# Altium project FireBeetle ESP32 IoT & Sensors.PrjPcb
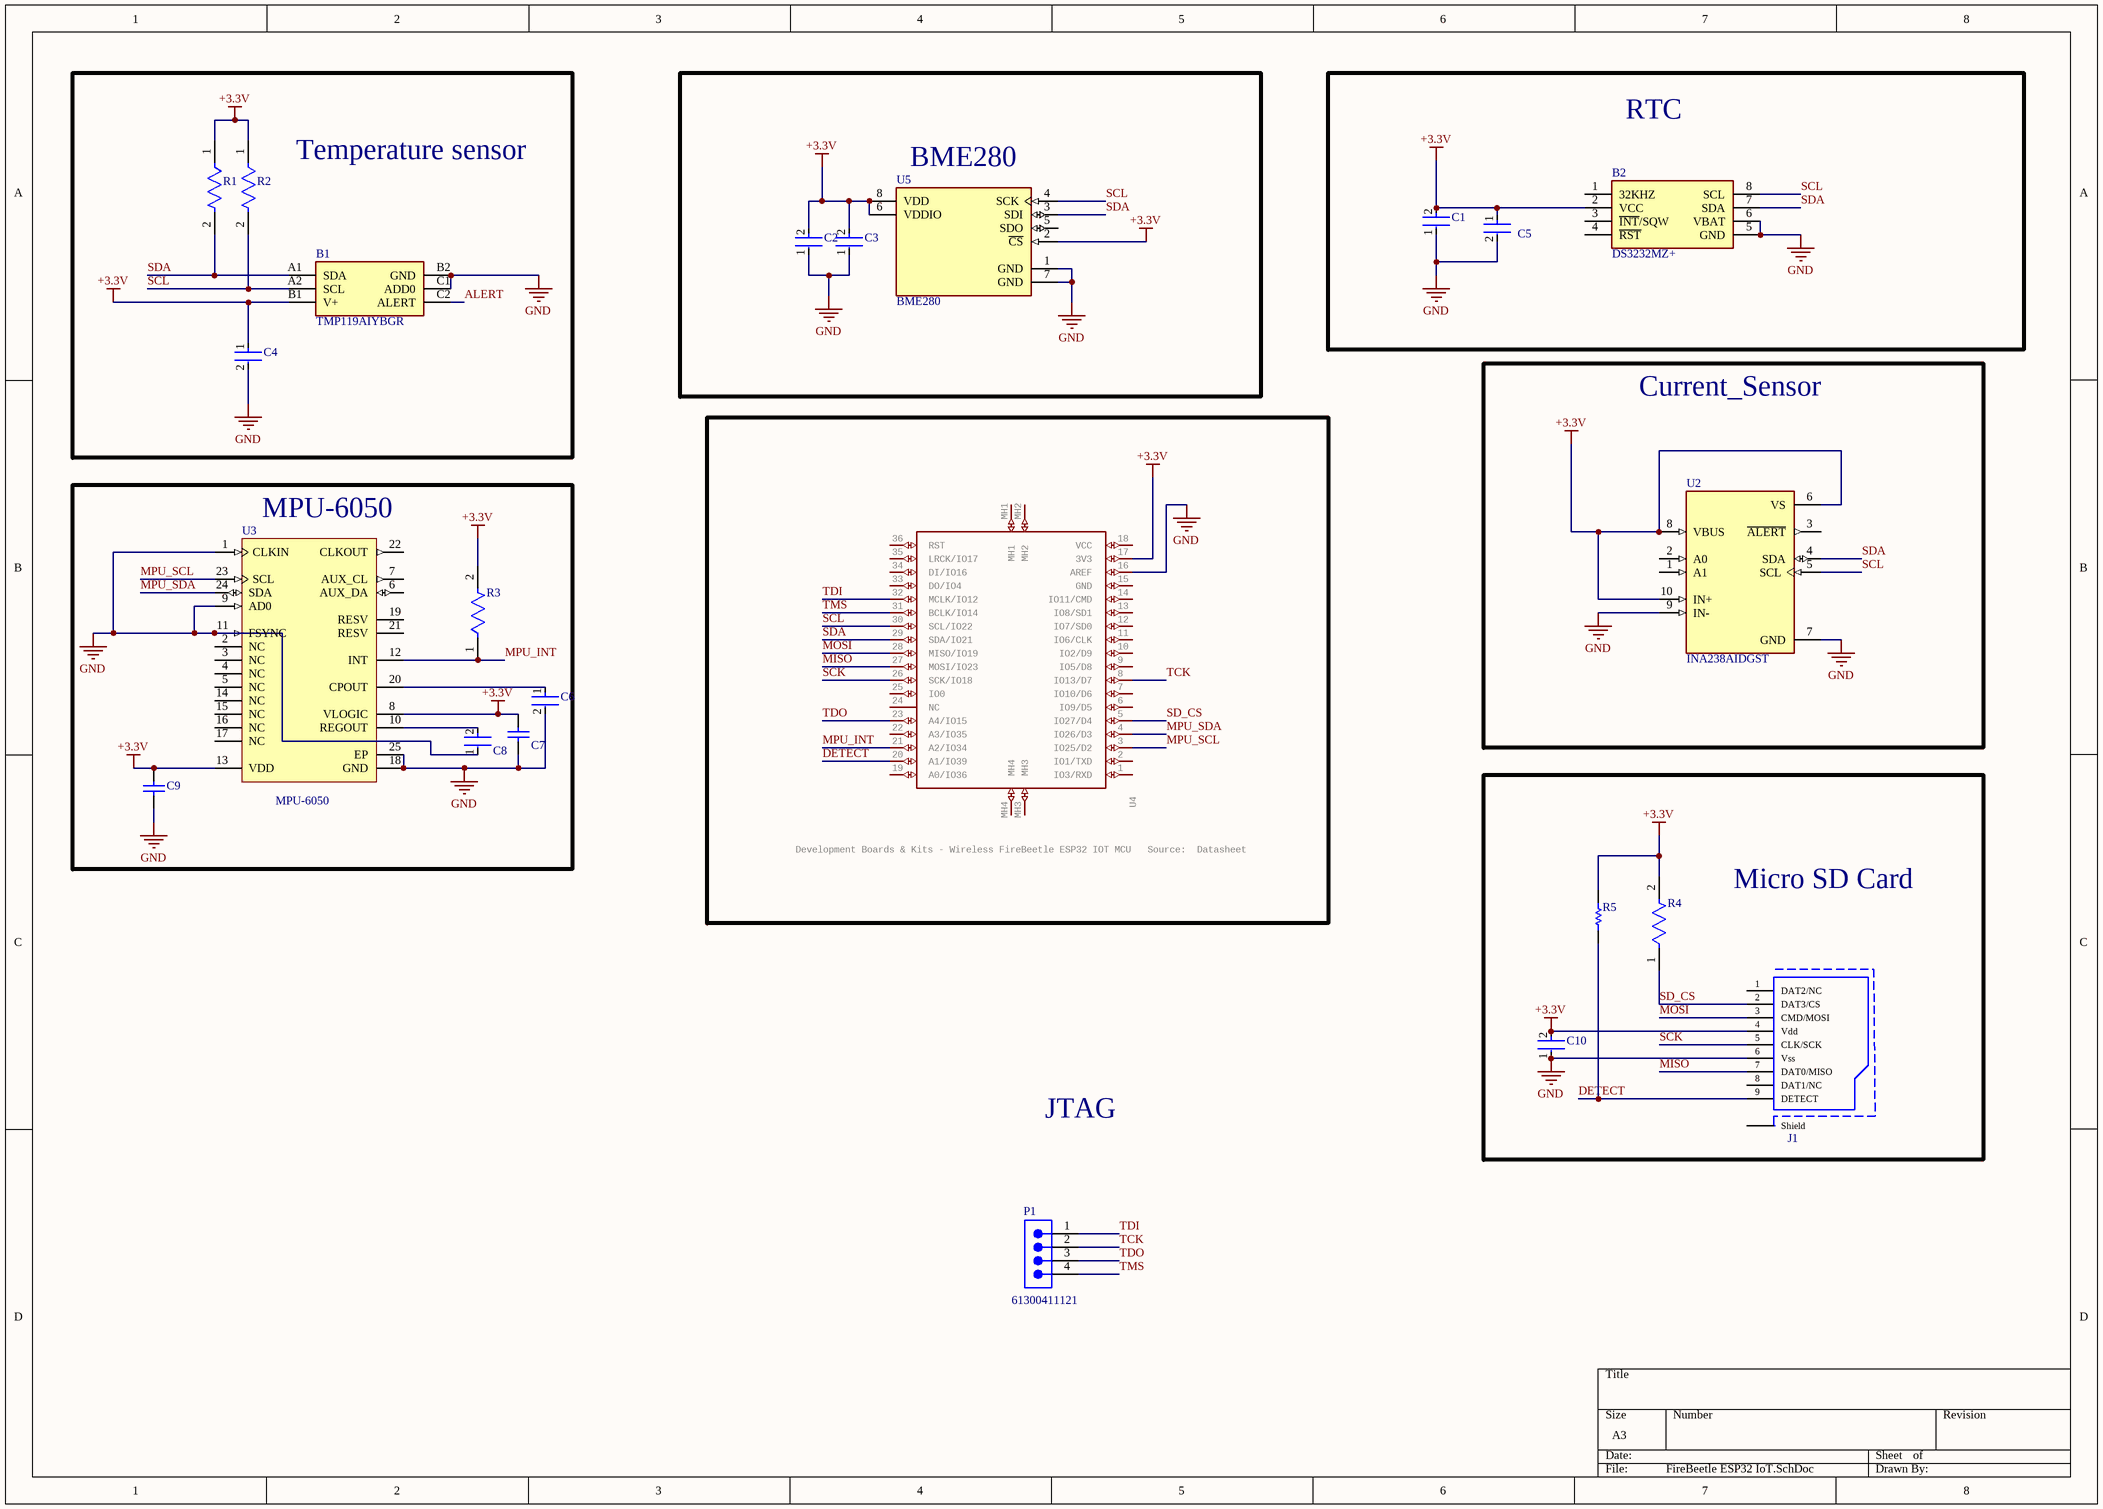
[diagram p0: FireBeetle ESP32 IoT.SchDoc]
1 sheet, 23 parts. Net scope: global (net labels, ports and power ports of the same name join across sheets).
Board file: FireBeetle ESP32 IoT & Sensors.PcbDoc

## Sheet FireBeetle ESP32 IoT.SchDoc
size A3; SheetNumber: 1; SheetTotal: 1

### Parts
B1  TMP119AIYBGR  [BGA6C40P2X3_95X149X52]
B2  DS3232MZ+  [SOIC127P600X175-8N]
C1  GRM155R71C104KA88D  [FP-GRM15-MFG]  (value not drawn)
C2  GRM155R71C104KA88D  [FP-GRM15-MFG]  (value not drawn)
C3  GRM155R71C104KA88D  [FP-GRM15-MFG]  (value not drawn)
C4  CC0201KRX5R5BB104  [FP-CC0201-BA-MFG]  (value not drawn)
C5  GRM155R61A105KE15D  [FP-GRM15-0_1-MFG]  (value not drawn)
C6  GRM155R71H222KA01D  [FP-GRM155-0_05-IPC_B]  (value not drawn)
C7  GRM155R71E103KA01D  [CAPC1005X55X25ML05T10]  (value not drawn)
C8  GRM155R71C104KA88D  [FP-GRM15-MFG]  (value not drawn)
C9  GRM155R61A104KA01D  [CAPC1005X55X25ML5T10]  (value not drawn)
C10  GRM155R71C104KA88D  [FP-GRM15-MFG]  (value not drawn)
J1  Micro SD  [TFP-09-2-12B]  (value not drawn)
P1  61300411121  [61300411121]
R1  ERJ-1GNF4701C  [FP-ERJ0201-MFG]  (value not drawn)
R2  ERJ-1GNF4701C  [FP-ERJ0201-MFG]  (value not drawn)
R3  ERJ-2RKF1003X  [FP-ERJ2RK-IPC_C]  (value not drawn)
R4  ERJ-2RKF1003X  [FP-ERJ2RK-IPC_C]  (value not drawn)
R5  ERJ-2RKF1004X  [RESC1005X40X25LL05T05]  (value not drawn)
U2  INA238AIDGST  [SOP50P490X110-10N]
U3  MPU-6050  [IS-QFN-24_V]
U4  Development Boards & Kits - Wireless FireBeetle ESP32 IOT MCU   Source:  Datasheet  [FIREBEETLE_ESP32]
U5  BME280  [FP-BME280-MFG]

### Blocks framed on the sheet
Temperature sensor: B1 C4 R1 R2
BME280: C2 C3 U5
RTC: B2 C1 C5
Current_Sensor: U2
MPU-6050: C6-C9 R3 U3
Micro SD Card: C10 J1 R4 R5

### Nets
+3.3V: B1.B1(V+) B2.2(VCC) C1.2 C2.2 C3.2 C4.1 C5.1 C7.2 C9.2 C10.2 J1.4(Vdd) R1.1 R2.1 R3.2 R4.2 R5.2 U2.6(VS) U2.8(VBUS) U2.10(IN+) U3.8(VLOGIC) U3.13(VDD) U4.17(3V3) U5.2(~{CS}) U5.6(VDDIO) U5.8(VDD)
GND: B1.B2(GND) B1.C1(ADD0) B2.5(GND) B2.6(VBAT) C1.1 C2.1 C3.1 C4.2 C5.2 C6.2 C7.1 C8.1 C9.1 C10.1 J1.6(Vss) U2.7(GND) U2.9(IN-) U3.1(CLKIN) U3.9(AD0) U3.11(FSYNC) U3.18(GND) U3.25(EP) U4.16(AREF) U5.1(GND) U5.7(GND)
ALERT: B1.C2(ALERT)
DETECT: J1.9(DETECT) R5.1 U4.20(A1/IO39)
MISO: J1.7(DAT0/MISO) U4.27(MOSI/IO23)
MOSI: J1.3(CMD/MOSI) U4.28(MISO/IO19)
MPU_INT: R3.1 U3.12(INT) U4.21(A2/IO34)
MPU_SCL: U3.23(SCL) U4.3(IO25/D2)
MPU_SDA: U3.24(SDA) U4.4(IO26/D3)
SCK: J1.5(CLK/SCK) U4.26(SCK/IO18)
SCL: B1.A2(SCL) B2.8(SCL) R2.2 U2.5(SCL) U4.30(SCL/IO22) U5.4(SCK)
SD_CS: J1.2(DAT3/CS) R4.1 U4.5(IO27/D4)
SDA: B1.A1(SDA) B2.7(SDA) R1.2 U2.4(SDA) U4.29(SDA/IO21) U5.3(SDI)
TCK: P1.2 U4.8(IO13/D7)
TDI: P1.1 U4.32(MCLK/IO12)
TDO: P1.3 U4.23(A4/IO15)
TMS: P1.4 U4.31(BCLK/IO14)
NetC6_1: C6.1 U3.20(CPOUT)
NetC8_2: C8.2 U3.10(REGOUT)

Not connected (* = marked no-connect by the designer): B2 1(32KHZ) 3(~{INT}/SQW) 4(~{RST}); J1 1(DAT2/NC) 8(DAT1/NC) 10(Shield); U2 1(A1) 2(A0) 3(~{ALERT}); U3 2(NC) 3(NC) 4(NC) 5(NC) 6(AUX_DA) 7(AUX_CL) 14(NC) 15(NC) 16(NC) 17(NC) 19(RESV) 21(RESV) 22(CLKOUT); U4 1(IO3/RXD) 2(IO1/TXD) 6(IO9/D5) 7(IO10/D6) 9(IO5/D8) 10(IO2/D9) 11(IO6/CLK) 12(IO7/SD0) 13(IO8/SD1) 14(IO11/CMD) 15(GND) 18(VCC) 19(A0/IO36) 22(A3/IO35) 24(NC) 25(IO0) 33(DO/IO4) 34(DI/IO16) 35(LRCK/IO17) 36(RST) MH1 MH2 MH3 MH4; U5 5(SDO)

### Notes on the sheet
- JTAG

### Library data of the parts
B1 = TMP119AIYBGR: Board Mount Temperature Sensors TEMPERATURE SENSOR; Manufacturer_Name: Texas Instruments; Geometry.Height: 0.525mm; Manufacturer_Part_Number: TMP119AIYBGR; Mouser Part Number: *; Mouser Price/Stock: *; Arrow Part Number: *; Arrow Price/Stock: *; Datasheet Link: https://www.ti.com/lit/ds/symlink/tmp119.pdf?ts=1711471230059&ref_url=https%253A%252F%252Fwww.ti.com%252Fsitesearch%252Fen-us%252Fdocs%252Funiversalsearch.tsp%253FlangPref%253Den-US%2526searchTerm%253Dtmp119%2526nr%253D70
B2 = DS3232MZ+: Real Time Clock with SRAM I2C SOIC8 Maxim DS3232MZ+ Real Time Clock  Calendar, 236B RAM 8-Pin SOIC; Manufacturer_Name: Analog Devices; Geometry.Height: 1.75mm; Manufacturer_Part_Number: DS3232MZ+; Mouser Part Number: 700-DS3232MZ+; Mouser Price/Stock: https://www.mouser.co.uk/ProductDetail/Analog-Devices-Maxim-Integrated/DS3232MZ%2b?qs=jx0ze0HFsp7XmMGNDj6kPg%3D%3D; Arrow Part Number: DS3232MZ+; Arrow Price/Stock: https://www.arrow.com/en/products/ds3232mz/analog-devices?region=nac; Datasheet Link: https://datasheets.maximintegrated.com/en/ds/DS3232M.pdf
C1-C3 C8 C10 = CMP-2100-03641-2: CAP CER 0.1UF 16V X7R 0402; Manufacturer: Murata; Standoff Height: 0mm; Tolerance: 10%; Voltage Rating: 16Vdc; Material: Ceramic; Capacitance: 0.10μF; Value: 0.10μF; RoHS: TRUE; Manufacturer Part Number: GRM155R71C104KA88D; Temperature Characteristic: X7R; Octopart: https://octopart.com/grm155r71c104ka88d-murata-196880; Digikey Description: CAP CER 0.1UF 16V X7R 0402; Device Class L3: Ceramic Capacitors; Height: 0.55mm; ComponentLink2Description: Datasheet; Temperature Range Low: -55°C; Ipc Land Pattern Name: CAPC10050X219; ComponentLink2URL: https://search.murata.co.jp/Ceramy/image/img/A01X/G101/ENG/GRM155R71H471KA01-01A.pdf; Device Class L1: Passive Components; Lead Free: yes; Category: Cap; Package: GRM15; Temperature: -55°C to +125°C; Device Class L2: Capacitors; Temperature Range High: +125°C; Mouser Description: 0402 0.1 uF 16V ±10 % Tolerance X7R SMT Multilayer Ceramic Capacitor
C4 = CMP-03422-000376-1: CAP CER 0.1UF 6.3V X5R 0201; Manufacturer: Yageo; Tolerance: 0.1; Temperature Coefficient: 15%; Value: 100 nF; Material: Ceramic; Automotive: No; Device Class L2: Capacitors; Temperature Range High: +85°C; Capacitance: 100 nF; Temperature: -55°C to +85°C; ComponentLink2URL: http://www.yageo.com/documents/recent/UPY-GPHC_X5R_4V-to-50V_25.pdf; Category: Cap; Mouser Description: Multilayer Ceramic Capacitors MLCC - SMD/SMT 100nF 6.3V X5R 10%; Ipc Land Pattern Name: CAPC6030X30; Temperature Characteristic: X5R; Voltage Rating: 6.3 V; Lead Free: Yes; Digikey Description: CAP CER 0.1UF 6.3V X5R 0201; Device Class L1: Passive Components; Octopart: https://octopart.com/cc0201krx5r5bb104-yageo-9292636; Height: 0.33mm; Package: CC0201-BA; Footprint Url: http://www.yageo.com/exep/pages/download/literatures/UPY-C_GEN_24.pdf; ComponentLink2Description: Datasheet; Device Class L3: Ceramic Capacitors; Temperature Range Low: -55°C; RoHS: TRUE; Manufacturer Part Number: CC0201KRX5R5BB104
C5 = CMP-2008-04556-2: CAP CER 1UF 10V X5R 0402; Manufacturer: Murata; Material: Ceramic; Tolerance: 10%; Temperature Coefficient: 15%; Octopart: https://octopart.com/grm155r61a105ke15d-murata-197442; Manufacturer Part Number: GRM155R61A105KE15D; Lead Free: Yes; ComponentLink2Description: Datasheet; Temperature: -55°C to +85°C; Temperature Range High: +85°C; Height: 0.55mm; Capacitance: 1uF; Ipc Land Pattern Name: CAPC10050X50; ComponentLink2URL: https://search.murata.co.jp/Ceramy/image/img/A01X/G101/ENG/GRM155R61A105KE15-01A.pdf; Temperature Range Low: -55°C; Device Class L2: Capacitors; Voltage Rating: 10V; RoHS: TRUE; Device Class L1: Passive Components; Device Class L3: Ceramic Capacitors; Temperature Characteristic: X5R; Mouser Description: 0402 1 uF 10 V ±10% Tolerance X5R Surface Mount Multilayer Ceramic Capacitor; Automotive: No; Package: GRM15-0.1; Digikey Description: CAP CER 1UF 10V X5R 0402; Value: 1uF; Category: Cap
C6 = CMP-2008-04653-5: Chip Multilayer Ceramic Capacitors for General Purpose, 0402, 2200pF, X7R, 15%, 10%, 50V; Capacitance: 2.2nF; Voltage: 50V; Case/Package: 0402; Case Code (Imperial): 0402; Dielectric: X7R; Thickness: 0.022inch; Number of Pins: 2; Voltage Rating (DC): 50V; Weight: 2.3E-05oz; Min Operating Temperature: -55°C; REACH SVHC: No SVHC; Length: 1mm; Case Code (Metric): 1005; Lead Free: Lead Free; Tolerance: 10%; Max Operating Temperature: 125°C; Package Quantity: 1; Packaging: Tape and Reel; Termination: SMD/SMT; Radiation Hardening: No; Depth: 0.5mm; Material: Ceramic; Width: 0.5mm; Mount: Surface Mount; Voltage Rating: 50V; Height: 0.5mm
C7 = CMP-1034-01880-2: Manufacturer: Murata; Part Number: GRM155R71E103KA01D
C9 = CMP-1662-00019-1: Chip Capacitor, 100 nF, +/- 10%, 10 V, -55 to 85 degC, 0402 (1005 Metric), RoHS, Tape and Reel; Capacitance: 100 nF; Type (Capacitors): X5R; Voltage Rating: 10 V; ComponentLink2Description: Datasheet; Package Quantity: 1; PackageDescription: 2-Pin Surface Mount Device, Body 1 x 0.5 mm; DatasheetVersion: 05/2014; ComponentLink2URL: https://datasheet.ciiva.com/18102/getdatasheetpartid-74533-18102605.pdf; Case/Package: 0402; Case Code (Metric): 1005; Mounting Technology: Surface Mount; Max Operating Temperature: 85 degC; RoHSCompliant: true; Case Code (Imperial): 0402; ComponentLink1URL: http://www.murata.com/; ComponentLink1Description: Manufacturer URL; Pins: 2; Length: 1 mm; Width: 0.5 mm; Radiation Hardening: No; Voltage Rating (DC): 10 V; Tolerance: 10%; Packaging: Cut Tape; PartNumber: GRM155R61A104KA01D; Height: 0.5 mm; REACH SVHC: Unknown; Mount: Surface Mount; Min Operating Temperature: -55 degC
J1 = Micro SD TFP-09-2-12B: PartNumber: TFP-09-2-12B
P1 = CMP-1502-01064-2: NexarPartId: 32855522; Pitch: 2.54mm; Number of Contacts: 4; Contact Resistance: 20mΩ; Gender: Male; Current Rating: 3A; Connector Type: Male Pin; Voltage Rating: 250V; Lead Free: Lead Free; Contact Plating: Gold; Max Operating Temperature: 105°C; Packaging: Bulk; Height: 8.89mm; Orientation: Vertical; Contact Mating Length: 5.9944mm; Contact Material: Copper; Lead Pitch: 2.54mm; Min Operating Temperature: -40°C; Termination: Solder; Color: Black; Number of Rows: 1; REACH SVHC: Unknown; RoHS: Compliant; Mount: Through Hole; Number of Positions: 4; Number of Pins: 4; Operating Supply Voltage: 250V
R1 R2 = CMP-1010-00492-3: RES SMD 4.7K OHM 1% 1/20W 0201; Manufacturer: Panasonic Electronic Components; Temperature Coefficient: 200ppm/°C; Automotive Grade: Grade 1; Resistance: 4.7kΩ; Voltage Rating: 25V; Power Rating: 0.05W; Value: 4.7kΩ; Category: Res; Height: 0.26mm; Footprint Url: https://industrial.panasonic.com/cdbs/www-data/pdf/RDA0000/DMA0000COL17.pdf; Temperature Range High: +125°C; Series: ERJ; Mouser Description: Thick Film Resistors - SMD 0201 4.7Kohm 1% HalogenFree AEC-Q200; Digikey Description: RES SMD 4.7K OHM 1% 1/20W 0201; Device Class L3: Chip SMD Resistors; Manufacturer Part Number: ERJ-1GNF4701C; Package: ERJ0201; Device Class L1: Passive Components; Octopart: https://octopart.com/erj-1gnf4701c-panasonic-55560010; RoHS: TRUE; ComponentLink2Description: Datasheet; Temperature: -55°C to +125°C; Ipc Land Pattern Name: RESC6030X23; Device Class L2: Resistors; Lead Free: Yes; Temperature Range Low: -55°C; Composition: Thick Film; ComponentLink2URL: https://industrial.panasonic.com/cdbs/www-data/pdf/RDA0000/AOA0000C304.pdf; Automotive: Yes; Tolerance: 1%
R3 R4 = CMP-2002-00608-4: RES SMD 100K OHM 1% 1/10W 0402; Resistance: 100kR; Voltage Rating (DC): 50V; Power Rating: 100mW; Temperature Coefficient: 100ppm/°C; Case/Package: 0402; Length: 1mm; Package Quantity: 1; Radiation Hardening: No; Case Code (Metric): 1005; Contact Plating: Tin; Mount: Surface Mount; Depth: 0.5mm; Max Operating Temperature: 155°C; Lead Free: Lead Free; Width: 0.5mm; Composition: Thick Film; Case Code (Imperial): 0402; Tolerance: 1%; Termination: SMD/SMT; Number of Pins: 2; Height: 0.35mm; Voltage Rating: 50V; Military Standard: Not; REACH SVHC: No SVHC; Packaging: Tape and Reel; Min Operating Temperature: -55°C; Max Power Dissipation: 100mW; Features: Automotive AEC-Q200; Number of Terminations: 2
R5 = CMP-2002-00609-3: Chip Resistor, 1 MOhm, +/- 1%, 100 mW, -55 to 155 degC, 0402 (1005 Metric), RoHS, Tape and Reel; Manufacturer: Basic Passives; Voltage Rating: 50 V; Case\/Package: 0402; Resistance: 1 MOhm; Power Rating: 100 mW; Pins: 2; Max Operating Temperature: 155 degC; ComponentLink2URL: http://industrial.panasonic.com/cdbs/www-data/pdf/RDA0000/AOA0000C86.pdf; Weight: 2.8E-05oz; ComponentLink1URL: http://www.panasonic.com/; Radiation Hardening: No; Height: 0.35 mm; Case Code (Imperial): 0402; ComponentLink2Description: Datasheet; Mount: Surface Mount; ComponentLink1Description: Manufacturer URL; REACH SVHC: Yes; PartNumber: ERJ-2RKF1004X; Length: 1 mm; Min Operating Temperature: -55 degC; Width: 0.5 mm; Package Quantity: 10000; Tolerance: 1%; PackageDescription: 2-Pin Surface Mount Device, Body 1 x 0.5 mm; RoHSCompliant: true; DatasheetVersion: 04/2015; PackageReference: 0402; Mounting Technology: Surface Mount; Case Code (Metric): 1005; Packaging: Tape and Reel
U3 = CMP-1753-00002-2: 3-Axis Gyroscope, Accelerometer and a Digital Motion Processor(TM) (DMP), 2.375 to 3.46 V, -40 to 85 degC, 24-Pin QFN, RoHS, Tape and Reel; Manufacturer: InvenSense; Featured Product: MPU-60506-Axis,IntegratedI²CSolution; Other Names: 1428-1007-2 / MPU6050; Sensor Type: MotionTracking; Online Catalog: MPU-6000™Series; Unit PriceUSD: Digital; Datasheet Version: Rev. 3.3, 05/2012; Category: Sensors,Transducers; Datasheet URL: http://datasheet.octopart.com/MPU-6050-InvenSense-datasheet-14421344.pdf; Family: Multifunction; Standard Package: 5,000; Manufacturer URL: http://www.invensense.com/; Output Type: Digital; Dynamic Catalog: MPU-6000™Series
U4 = DFR0478: Manufacturer_Name: DFRobot; GateName_1: G$1; SymbolName_1: DFR0478; LibraryName: DFR0478; DeviceSetName: DFR0478; Package: FIREBEETLE_ESP32; Manufacturer_Part_Number: DFR0478; Mouser_Part_Number: 426-DFR0478; Mouser_Price-Stock: https://www.mouser.co.uk/ProductDetail/DFRobot/DFR0478?qs=EU6FO9ffTwc%252BR65h2NUGQw%3D%3D; Arrow_Part_Number: DFR0478; Arrow_Price-Stock: https://www.arrow.com/en/products/dfr0478/dfrobot?region=nac; Height: mm
U5 = CMP-2000-05073-3: SENSOR PRESSURE HUMIDITY TEMP; Sensor Type: Temperature; Accuracy: 3%; Response Time: 1s; Output Type: SPI; Min Operating Temperature: -40°C; Max Operating Temperature: 85°C; Case/Package: LGA; Packaging: Cut Tape; Mount: Surface Mount; Lead Free: Lead Free; Number of Pins: 8
U2 = INA238AIDGST: Value: *; Availability: Unavailable; Price: None; Package: None; MP: INA238AIDGST